# EAGLE design usb_serial (EAGLE 9.6.2)
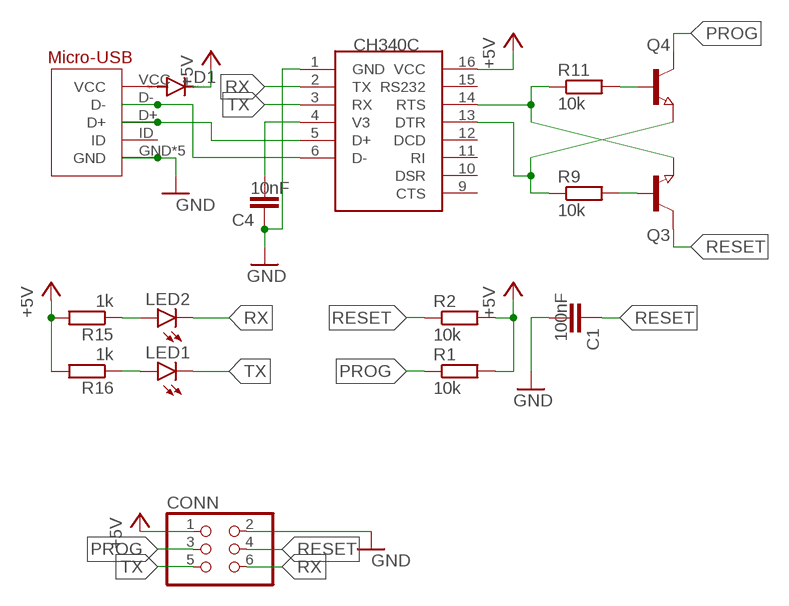
[diagram p0: schematic, sheet 1]

## Parts
C1  100nF  C-EUC0603K  [C0603K]
C4  10nF  C-EUC0603K  [C0603K]
CONN  PINHD-2X3  [2X03]
D1  DIODE-MICROMELF-R  [MICROMELF-R]
J1  MICRO-USB  [MICRO-USB]
LED1  LEDCHIPLED_0805  [CHIPLED_0805]
LED2  LEDCHIPLED_0805  [CHIPLED_0805]
Q3  NPN-TRANSISTOR_SOT23  [SOT23]
Q4  NPN-TRANSISTOR_SOT23  [SOT23]
R1  10k  R-EU_R0603  [R0603]
R2  10k  R-EU_R0603  [R0603]
R9  10k  R-EU_R0603  [R0603]
R11  10k  R-EU_R0603  [R0603]
R15  1k  R-EU_R0603  [R0603]
R16  1k  R-EU_R0603  [R0603]
U$3  CH340C  [SOIC16]

## Nets
+5V: CONN.1 D1.C R1.2 R2.2 R15.2 R16.2 U$3.16(VCC)
DTR: Q4.2(E) R9.1 U$3.13(DTR)
GND: C1.2 C4.1 CONN.2 J1.GND J1.GP1(GND) J1.GP2(GND) J1.GP3(GND) J1.GP4(GND) U$3.1(GND)
N$1: D1.A J1.VCC
N$5: C4.2 U$3.4(V3)
N$8: J1.D+ U$3.5(D+)
N$9: J1.D- U$3.6(D-)
N$10: Q3.1(B) R9.2
N$11: Q4.1(B) R11.2
N$12: LED1.A R16.1
N$13: LED2.A R15.1
PROG: CONN.3 Q4.3(C) R1.1
RESET: C1.1 CONN.4 Q3.3(C) R2.1
RTS: Q3.2(E) R11.1 U$3.14(RTS)
RX: CONN.6 LED2.C U$3.2(TX)
TX: CONN.5 LED1.C U$3.3(RX)
Unconnected: J1.ID U$3.9(CTS) U$3.10(DSR) U$3.11(RI) U$3.12(DCD) U$3.15(RS232)

## Library data of the parts
C1 C4 = rcl:C-EU: CAPACITOR, European symbol; SPICEPREFIX: C
CONN = pinhead:PINHD-2X3: PIN HEADER
D1 = diode:DIODE-: DIODE
J1 = micro-usb:MICRO-USB; BUILT_BY: EMA_Colton; COPYRIGHT: Copyright (C) 2018 Accelerated Designs. All rights reserved; DATASHEET: https://www.digikey.com/product-detail/en/hirose-electric-co-ltd/ZX62D-B-5P8-30/H125272TR-ND/5994738; MANUFACTURER_PART_NUMBER: ZX62D-B-5P8(30); SOURCELIBRARY: Hirose_2020-02-14; VENDOR: Hirose
LED1 LED2 = led:LED: LED OSRAM: - CHIPLED LG R971, LG N971, LY N971, LG Q971, LY Q971, LO R971, LY R971 LH N974, LH R974 LS Q976, LO Q976, LY Q976 LO Q996 - Hyper CHIPLED LW Q18S LB Q993, LB Q99A, LB R99A - SideLED LS A670, LO A670, LY A670, LG A670, LP A670 LB A673, LV A673, LT A673, LW A673 LH A674 LY A675 LS A676, LA A676, LO A676, LY A676, LW A676 LS A679, LY A679, LG A679 - Hyper Micro SIDELED® LS Y876, LA Y876, LO Y876, LY Y876 LT Y87S - SmartLED LW L88C, LW L88S LB L89C, LB L89S, LG L890 LS L89K, LO L89K, LY L89K LS L896, LA L896, LO L896, LY L896 - TOPLED LS T670, LO T670, LY T670, LG T670, LP T670 LSG T670, LSP T670, LSY T670, LOP T670, LYG T670 LG T671, LOG T671, LSG T671 LB T673, LV T673, LT T673, LW T673 LH T674 LS T676, LA T676, LO T676, LY T676, LB T676, LH T676, LSB T676, LW T676 LB T67C, LV T67C, LT T67C, LS T67K, LO T67K, LY T67K, LW E67C LS E67B, LA E67B, LO E67B, LY E67B, LB E67C, LV E67C, LT E67C LW T67C LS T679, LY T679, LG T679 LS T770, LO T770, LY T770, LG T770, LP T770 LB T773, LV T773, LT T773, LW T773 LH T774 LS E675, LA E675, LY E675, LS T675 LS T776, LA T776, LO T776, LY T776, LB T776 LHGB T686 LT T68C, LB T68C - Hyper Mini TOPLED® LB M676 - Mini TOPLED Santana® LG M470 LS M47K, LO M47K, LY M47K Source: http://www.osram.convergy.de LUXEON: - LUMILED® LXK2-PW12-R00, LXK2-PW12-S00, LXK2-PW14-U00, LXK2-PW14-V00 LXK2-PM12-R00, LXK2-PM12-S00, LXK2-PM14-U00 LXK2-PE12-Q00, LXK2-PE12-R00, LXK2-PE12-S00, LXK2-PE14-T00, LXK2-PE14-U00 LXK2-PB12-K00, LXK2-PB12-L00, LXK2-PB12-M00, LXK2-PB14-N00, LXK2-PB14-P00, LXK2-PB14-Q00 LXK2-PR12-L00, LXK2-PR12-M00, LXK2-PR14-Q00, LXK2-PR14-R00 LXK2-PD12-Q00, LXK2-PD12-R00, LXK2-PD12-S00 LXK2-PH12-R00, LXK2-PH12-S00 LXK2-PL12-P00, LXK2-PL12-Q00, LXK2-PL12-R00 Source: www.luxeon.com KINGBRIGHT: KA-3528ASYC Source: www.kingbright.com
Q3 Q4 = semicon-smd-ipc:NPN-TRANSISTOR_: NPN TRANSISTOR
R1 R2 R9 R11 R15 R16 = rcl:R-EU_: RESISTOR, European symbol; SPICEPREFIX: R
U$3 = ch340c:CH340C

## Board
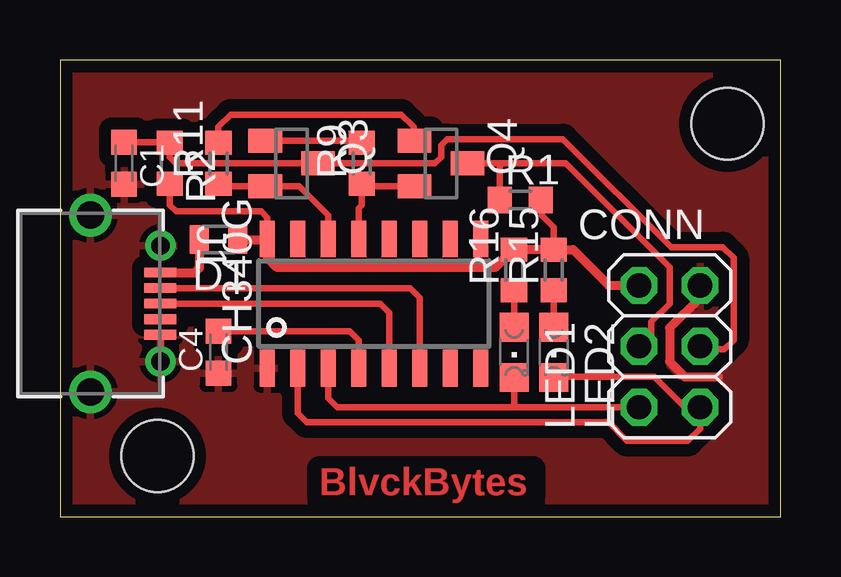
[diagram p1: board, top side]

Size 30.02 x 19.04 mm. Coordinates in mm from the lower left corner, seen from the top.
Outline: 0,0 30.02,0 30.02,19.04 0,19.04 0,0
Copper layers (1*16): Top 0.035mm / dielectric 1.5mm / Bottom 0.035mm
Design rules "default *": minimum track width 6mil, minimum drill 0.35mm, track to track 6mil, track to pad 6mil, pad to pad 6mil, via to via 6mil, smd to smd 6mil, copper to edge 12mil, drill to drill 6mil, minimum pad ring 10mil, minimum via ring 8mil, stop-mask expansion 4mil, vias tented up to drill 0mil, thermal gap 10mil
Holes 3 mm at 4.06,2.54 27.81,16.38

### Footprints (pad centres in the part's own frame; a part is rotated, then mirrored left to right if it is on the bottom)
C0603K = smd 1.05 x 1.08: 1 -0.875,0; 2 0.875,0
2X03 = drill 1.016 octagon: 1 -2.54,-1.27; 2 -2.54,1.27; 3 0,-1.27; 4 0,1.27; 5 2.54,-1.27; 6 2.54,1.27
MICROMELF-R = smd 0.8 x 1.2: A 0.8,0; C -0.8,0
MICRO-USB = smd 0.406 x 1.346: D+ 0,2.906; D- -0.65,2.906; GND 1.3,2.906; ID 0.65,2.906; VCC -1.3,2.906 | drill 0.762 pad 1.27: GP1 -2.413,2.921; GP2 2.413,2.921 | drill 1.143 pad 1.778: GP3 -3.683,0; GP4 3.683,0
CHIPLED_0805 = smd 1.2 x 1.2: A 0,-1.05; C 0,1.05
SOT23 = smd 1 x 1.4: 1 -0.95,-1.1; 2 0.95,-1.1; 3 0,1.1
R0603 = smd 1 x 1.1: 1 -0.85,0; 2 0.85,0
SOIC16 = smd 0.635 x 1.524: 1 -4.445,-2.695; 2 -3.175,-2.695; 3 -1.905,-2.695; 4 -0.635,-2.695; 5 0.635,-2.695; 6 1.905,-2.695; 7 3.175,-2.695; 8 4.445,-2.695; 9 4.445,2.695; 10 3.175,2.695; 11 1.905,2.695; 12 0.635,2.695; 13 -0.635,2.695; 14 -1.905,2.695; 15 -3.175,2.695; 16 -4.445,2.695

### Placement (x,y rotation side)
C1  2.67,14.73 270 top
C4  6.6,6.86 90 top
CONN  25.4,7.11 270 top
D1  6.6,11.56 180 top
J1  1.27,8.89 270 top
LED1  18.92,6.86 180 top
LED2  20.57,6.86 180 top
Q3  9.65,14.73 270 top
Q4  15.88,14.73 270 top
R1  19.18,13.21 0 top
R2  4.57,14.73 270 top
R9  12.57,14.73 90 top
R11  6.6,14.73 90 top
R15  20.57,10.29 90 top
R16  18.92,10.29 90 top
U$3  13.08,8.89 0 top

### Tracks (layer width: path | path; a pad name or v marks a point on that pad's centre or on a via)
+5V
  Top 0.279: 4.53,13.92 R2.2 4.57,12.99 4.84,12.73 8.38,12.73 8.64,12.47 U$3.16 8.61,11.56 | R16.2 18.88,11.14 | R1.2 20.07,13.17 20.07,12.57 20.57,12.07 R15.2
  Top 0.381: R16.2 R15.2 21.38,11.14 22.86,9.65 CONN.1 | 18.88,11.14 18.16,10.41 9.02,10.41 8.64,10.79 U$3.16 | D1.C 8.61,11.56
DTR
  Top 0.279: Q4.2 12.67,13.78 R9.1 12.57,12.98 12.45,12.85 U$3.13
GND
  Top 0.279: J1.GND 4.19,7.57 J1.GP2
  Top 0.381: 26.67,9.14 25.4,7.87 25.4,6.48 26.04,5.84 27.43,5.84
  pour Top (isolate 0.508): 0,19.05 0,0 29.97,0 29.97,19.05
N$1
  Top 0.279: 4.21,10.16 J1.VCC
  Top 0.381: D1.A 5.8,10.38 5.59,10.16 4.21,10.16
N$5
  Top 0.279: U$3.4 12.45,7.37 12.07,7.75 6.62,7.75 C4.2
N$8
  Top 0.279: U$3.5 13.72,8.51 13.34,8.89 J1.D+
N$9
  Top 0.279: J1.D- 14.59,9.54 14.99,9.14 U$3.6
N$10
  Top 0.279: R9.2 12.36,15.58 12.26,15.68 Q3.1
N$11
  Top 0.279: Q4.1 14.73,15.73 14.73,16.26 14.22,16.76 7.11,16.76 6.6,16.26 R11.2
N$12
  Top 0.279: R16.1 LED1.A
N$13
  Top 0.279: R15.1 LED2.A
PROG
  Top 0.279: 18.41,14.73 Q4.3 | R1.1 18.33,14.64 18.41,14.73 | CONN.3 24.64,7.62 24.64,8.13 25.4,8.89 25.4,10.41 21.08,14.73 18.41,14.73
RESET
  Top 0.279: 4.57,15.24 R2.1 4.53,15.62 | 4.57,15.24 4.57,14.99 4.83,14.73 Q3.3 15.62,14.73 15.88,14.99 15.88,15.49 16.13,15.75 20.96,15.75 25.46,11.24 27.62,11.24 28.07,10.79 28.07,7.37 27.69,6.98 26.8,6.98 CONN.4 | C1.1 4.21,15.61 4.57,15.24
RTS
  Top 0.279: R11.1 6.7,13.78 Q3.2 9.97,13.78 11.18,12.57 U$3.14
RX
  Top 0.279: LED2.C 20.61,5.84 24.77,5.84 26.04,4.57 CONN.6 26.67,3.68 26.16,3.18 23.62,3.18 22.86,3.94 10.29,3.94 9.91,4.32 U$3.2
TX
  Top 0.279: U$3.3 11.18,4.95 11.56,4.57 18.92,4.57 | CONN.5 18.92,4.57 | LED1.C 18.92,4.57

### Text on the board
Top: BlvckBytes